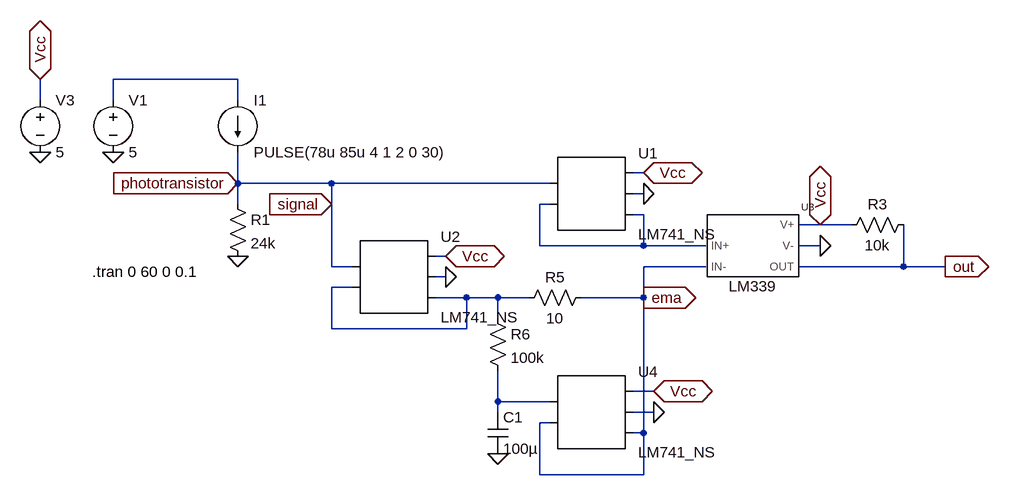
[diagram p0: schematic LightDetector (OpAmp, EMA).asc]
LightDetector (OpAmp, EMA).asc, the LTspice schematic file:
Version 4
SHEET 1 1408 916
WIRE 224 48 32 48
WIRE -80 80 -80 48
WIRE 32 80 32 48
WIRE 224 80 224 48
WIRE 848 192 832 192
WIRE 224 208 224 160
WIRE 368 208 224 208
WIRE 704 208 368 208
WIRE 848 224 832 224
WIRE 224 240 224 208
WIRE 368 240 368 208
WIRE 704 240 688 240
WIRE 848 256 832 256
WIRE 1120 272 1088 272
WIRE 1168 272 1120 272
WIRE 688 304 688 240
WIRE 848 304 848 256
WIRE 848 304 688 304
WIRE 944 304 848 304
WIRE 1120 304 1088 304
WIRE 544 320 528 320
WIRE 368 336 368 240
WIRE 400 336 368 336
WIRE 944 336 848 336
WIRE 1248 336 1248 272
WIRE 1248 336 1088 336
WIRE 1312 336 1248 336
WIRE 544 352 528 352
WIRE 400 368 368 368
WIRE 576 384 528 384
WIRE 624 384 576 384
WIRE 672 384 624 384
WIRE 848 384 848 336
WIRE 848 384 752 384
WIRE 624 416 624 384
WIRE 368 432 368 368
WIRE 576 432 576 384
WIRE 576 432 368 432
WIRE 864 528 832 528
WIRE 624 544 624 496
WIRE 704 544 624 544
WIRE 624 560 624 544
WIRE 864 560 832 560
WIRE 704 576 688 576
WIRE 848 592 848 384
WIRE 848 592 832 592
WIRE 688 656 688 576
WIRE 848 656 848 592
WIRE 848 656 688 656
FLAG 32 160 0
FLAG 224 320 0
FLAG 224 208 phototransistor
IOPIN 224 208 In
FLAG 624 624 0
FLAG 1120 304 0
FLAG 1312 336 out
IOPIN 1312 336 Out
FLAG 368 240 signal
IOPIN 368 240 In
FLAG 848 384 ema
IOPIN 848 384 Out
FLAG 544 352 0
FLAG 544 320 Vcc
IOPIN 544 320 BiDir
FLAG -80 160 0
FLAG -80 48 Vcc
IOPIN -80 48 BiDir
FLAG 848 192 Vcc
IOPIN 848 192 BiDir
FLAG 848 224 0
FLAG 1120 272 Vcc
IOPIN 1120 272 BiDir
FLAG 864 560 0
FLAG 864 528 Vcc
IOPIN 864 528 BiDir
SYMBOL voltage 32 64 R0
WINDOW 123 0 0 Left 0
WINDOW 39 0 0 Left 0
SYMATTR InstName V1
SYMATTR Value 5
SYMBOL current 224 80 R0
WINDOW 123 0 0 Left 0
WINDOW 39 0 0 Left 0
SYMATTR InstName I1
SYMATTR Value PULSE(78u 85u 4 1 2 0 30)
SYMBOL res 208 224 R0
SYMATTR InstName R1
SYMATTR Value 24k
SYMBOL res 768 368 R90
WINDOW 0 0 56 VBottom 2
WINDOW 3 32 56 VTop 2
SYMATTR InstName R5
SYMATTR Value 10
SYMBOL res 608 400 R0
SYMATTR InstName R6
SYMATTR Value 100k
SYMBOL cap 608 560 R0
SYMATTR InstName C1
SYMATTR Value 100µ
SYMBOL AutoGenerated\\LM339 1008 320 R0
SYMATTR InstName U3
SYMBOL res 1264 256 R90
WINDOW 0 0 56 VBottom 2
WINDOW 3 32 56 VTop 2
SYMATTR InstName R3
SYMATTR Value 10k
SYMBOL voltage -80 64 R0
WINDOW 123 0 0 Left 0
WINDOW 39 0 0 Left 0
SYMATTR InstName V3
SYMATTR Value 5
SYMBOL AutoGenerated\\LM741_NS 736 224 R0
SYMATTR InstName U1
SYMBOL AutoGenerated\\LM741_NS 432 352 R0
SYMATTR InstName U2
SYMBOL AutoGenerated\\LM741_NS 736 560 R0
SYMATTR InstName U4
TEXT 0 344 Left 2 !.tran 0 60 0 0.1

The netlist it stands for:
* LightDetector (OpAmp, EMA).asc
V1 N001 0 5
I1 N001 signal PULSE(78u 85u 4 1 2 0 30)
R1 signal 0 24k
R5 ema N003 10
R6 N003 N004 100k
C1 N004 0 100µ
XU3 N002 ema Vcc 0 out LM339  ; pins IN+ IN- V+ V- OUT
R3 out Vcc 10k
V3 Vcc 0 5
* U1: LM741_NS (symbol AutoGenerated\LM741_NS not available, pins judged from their places): pin1=signal pin2=N002 pin3=Vcc pin4=0 pin5=N002
* U2: LM741_NS (symbol AutoGenerated\LM741_NS not available, pins judged from their places): pin1=signal pin2=N003 pin3=Vcc pin4=0 pin5=N003
* U4: LM741_NS (symbol AutoGenerated\LM741_NS not available, pins judged from their places): pin1=N004 pin2=ema pin3=Vcc pin4=0 pin5=ema
.tran 0 60 0 0.1
.lib C:\Users\antro\Desktop\idp\LTspice\LM339.sub
.backanno
.end